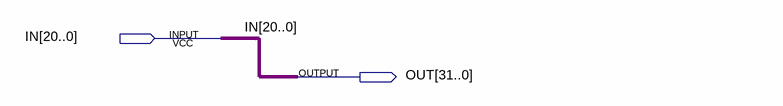
[diagram p0: schematic sheet]
// Quartus schematic signext21_32.bdf as structural Verilog: 0 symbols, 2 pins
module signext21_32 (
  input  [20:0] IN,
  output [31:0] OUT
);


  assign OUT = {{12{IN[20]}}, IN[19:0]};
endmodule
